# Altium project XL6009.PrjPCB
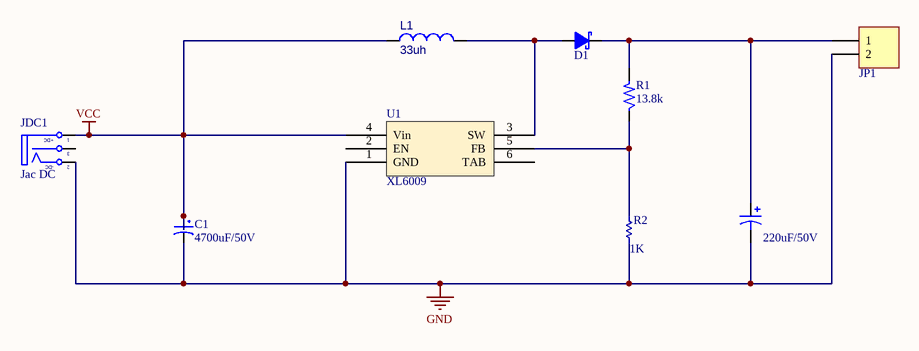
[diagram p0: Sheet1_XL6009.SchDoc]
1 sheet, 9 parts. Net scope: global (net labels, ports and power ports of the same name join across sheets).
Board file: PCB_XL6009.PcbDoc

## Sheet Sheet1_XL6009.SchDoc
size A4

### Parts
C1  4700uF/50V  [CP4/8.5]
C22  value 220uF/50V  [CP2/5]  (hidden comment: Cap Pol3)
D1  Diode  Schottky 1N5819  [DO-214AC]  (value not drawn)
JDC1  Jac DC  [DC-IN]
JP1  Header 2_1  [HED2]  (value not drawn)
L1  33uh  [IND_COILCRAFT_LPS4018]
R1  13.8k  [SM-RES-1206]
R2  value 1K  [RES 1/2W]  (hidden comment: Resistor 1/4W)
U1  XL6009  [LM2596]

### Nets
GND: C1.2 C22.2 JDC1.2(TN) JP1.2 R2.1 U1.1(GND)
VCC: C1.1 JDC1.1(T) L1.1 U1.4(Vin)
NetC22_1: C22.1 D1.K JP1.1 R1.2
NetD1_A: D1.A L1.2 U1.3(SW)
NetR1_1: R1.1 R2.2 U1.5(FB)

Not connected (* = marked no-connect by the designer): JDC1 3(S); U1 2(EN) 6(TAB)

### Notes on the sheet
- Title
- Size:
- Date:
- A4
- Number:
- Time:
- Revision:
- Sheet
- of
- File:
- (in symbol DCIN) +DC; -DC

### Library data of the parts
C1 = CP7: Cap 4700uF/50V; Value: 4700uF/50V
C22 = Cap Pol3: Polarized Capacitor (Surface Mount); VALUE: C?; LatestRevisionDate: 17-Jul-2002; LatestRevisionNote: Re-released for DXP Platform.; PackageReference: C0805; Publisher: Altium Limited
D1 = Diode  Schottky 1N5819: Diode 1A; Value: 1N4007
JDC1 = DCIN: Jac DC input; Value: Jac DC
JP1 = Header 2_1: Header, 2-Pin; Manufacturer: Generic Components; Class: Connector; Value: Header 2
L1 = INDC_120u_LPS4018: Inductor shielded 120uH 300mA LPS4018 SMD; Manufacturer 1: Coilcraft; Manufacturer Part Number 1: LPS4018-124ML; Ratings: 300 mArms; Tolerance: ±20%; Value: 120µ; Type: Ferrite Core; DC Resistance (DCR): 1.6 Ohm Max; Frequency - Self Resonant: 9MHz; Frequency - Test: 100kHz; Material - Core: Ferrite; SCDType: spec; Package / Case: LPS4018; Current: 300mA; Supplier 1: Coilcraft; Supplier Part Number 1: LPS4018-124MLC
R1 = R: Resistor 1/4W; Value: R1/4W - 1K
R2 = RES
U1 = XL6009: SMD